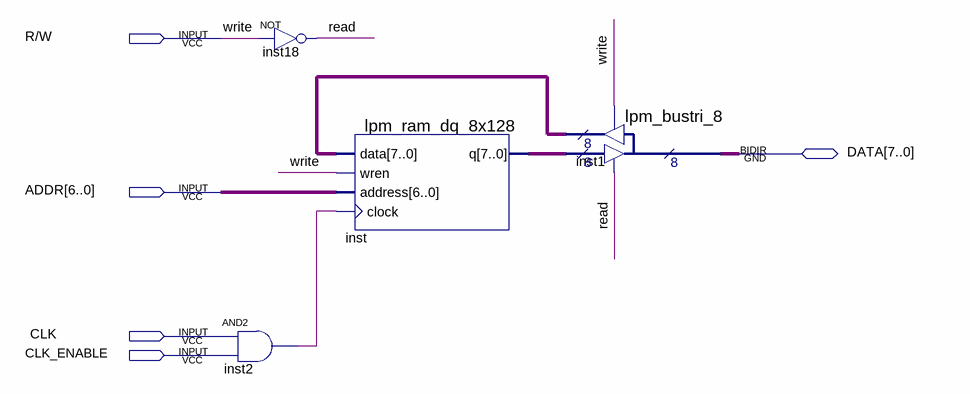
[diagram p0: schematic sheet]
// Quartus schematic device-ram.bdf as structural Verilog: 4 symbols, 5 pins
module \device-ram  (
  input  \R/W ,
  input  [6:0] ADDR,
  input  CLK,
  input  CLK_ENABLE,
  inout  [7:0] DATA
);

  wire inst2_out, read;
  wire [7:0] inst1_result, inst_q;

  not inst18 (read, \R/W );
  and inst2 (inst2_out, CLK, CLK_ENABLE);
  lpm_ram_dq_8x128 inst (.data(inst1_result), .wren(\R/W ), .address(ADDR), .clock(inst2_out), .q(inst_q));
  lpm_bustri_8 inst1 (.enabledt(read), .data(inst_q), .enabletr(\R/W ), .result(inst1_result), .tridata(DATA));

  // Other names for the same wires on the sheet: write = \R/W 
endmodule
